# Altium schematic sheet BLDC_SERVO.SchDoc
size A3
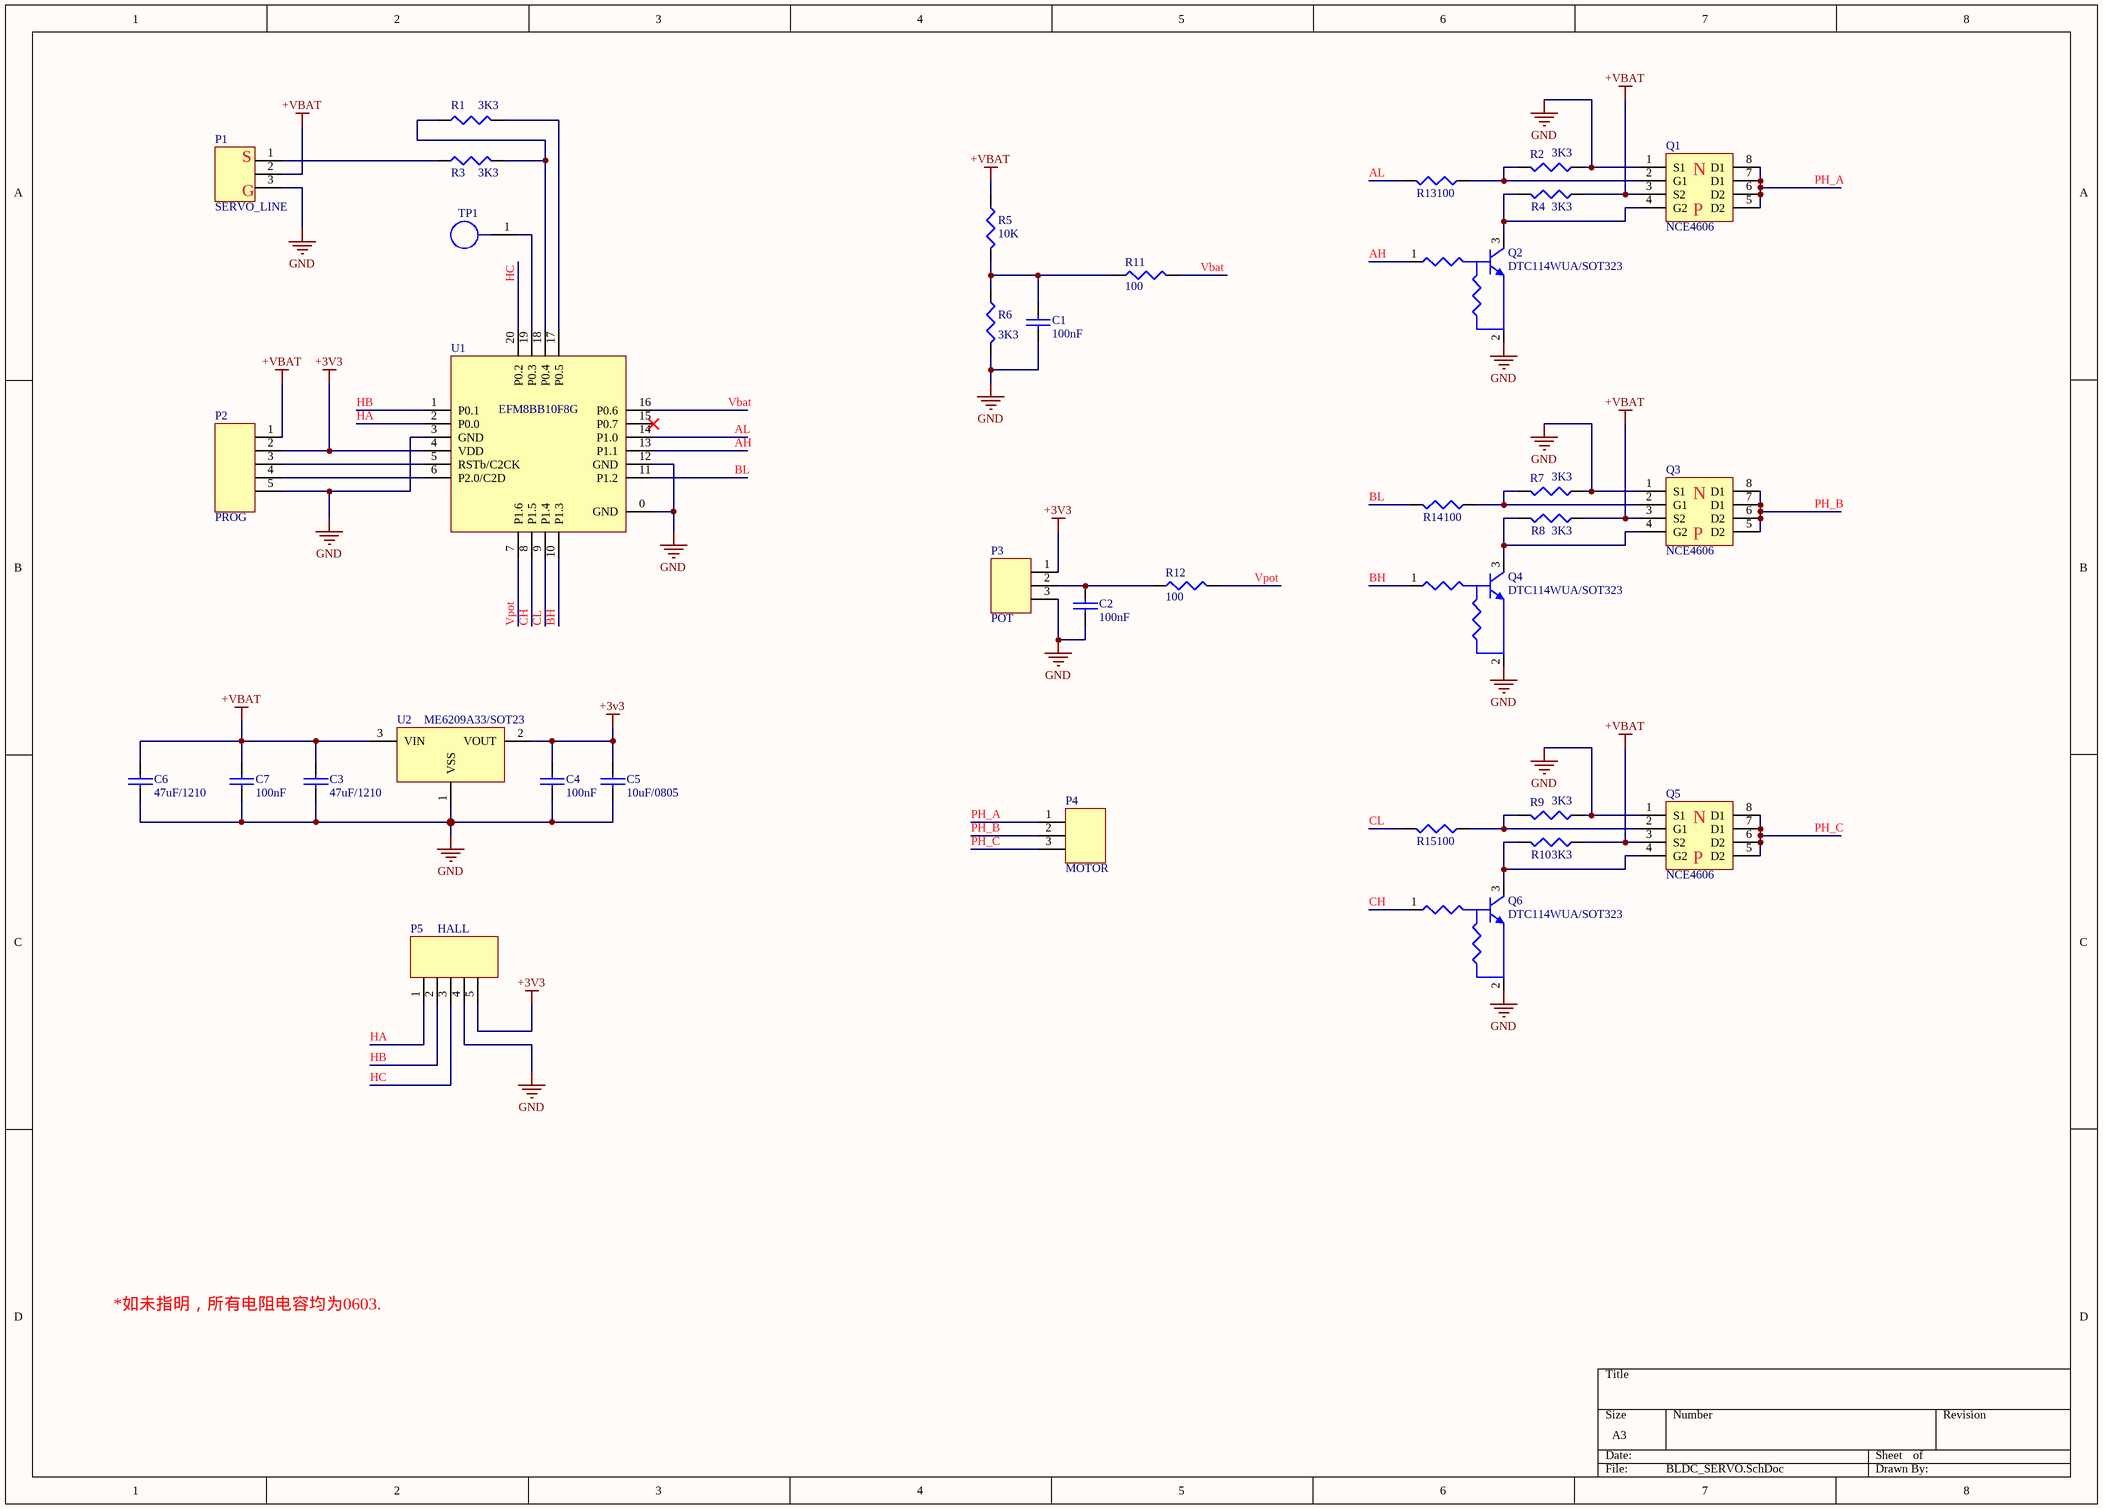
[diagram p0: BLDC_SERVO.SchDoc]

## Parts
C1  100nF  [ZHB_0603]
C2  100nF  [ZHB_0603]
C3  47uF/1210  [ZHB_1210]
C4  100nF  [ZHB_0603]
C5  10uF/0805  [ZHB_0805]
C6  47uF/1210  [ZHB_1210]
C7  100nF  [ZHB_0603]
P1  SERVO_LINE  ['CON_3]
P2  PROG  [PRO_5]
P3  POT  ['CON_3]
P4  MOTOR  ['CON_3]
P5  HALL  [ZHB_125T]
Q1  NCE4606  [ZHB_NCE4606]
Q2  DTC114WUA/SOT323  [ZHB_DTC114WUA]
Q3  NCE4606  [ZHB_NCE4606]
Q4  DTC114WUA/SOT323  [ZHB_DTC114WUA]
Q5  NCE4606  [ZHB_NCE4606]
Q6  DTC114WUA/SOT323  [ZHB_DTC114WUA]
R1  3K3  [ZHB_0603]
R2  3K3  [ZHB_0603]
R3  3K3  [ZHB_0603]
R4  3K3  [ZHB_0603]
R5  10K  [ZHB_0603]
R6  3K3  [ZHB_0603]
R7  3K3  [ZHB_0603]
R8  3K3  [ZHB_0603]
R9  3K3  [ZHB_0603]
R10  3K3  [ZHB_0603]
R11  100  [ZHB_0603]
R12  100  [ZHB_0603]
R13  100  [ZHB_0603]
R14  100  [ZHB_0603]
R15  100  [ZHB_0603]
TP1  PAD  [Check_point]  (value not drawn)
U1  EFM8BB10F8G  [ZHB_EFM8B10F8G]
U2  ME6209A33/SOT23  [ZHB_ME6208]

## Nets
+3V3: C4.2 C5.2 P2.2 P3.1 P5.5 U1.4(VDD) U2.2(VOUT)
+VBAT: C3.2 C6.2 C7.2 P1.2 P2.1 Q1.3(S2) Q3.3(S2) Q5.3(S2) R4.1 R5.1 R8.1 R10.1 U2.3(VIN)
GND: C1.1 C2.1 C3.1 C4.1 C5.1 C6.1 C7.1 P1.3 P2.5 P3.3 P5.4 Q1.1(S1) Q2.2 Q3.1(S1) Q4.2 Q5.1(S1) Q6.2 R2.1 R6.2 R7.1 R9.1 U1.0(GND) U1.3(GND) U1.12(GND) U2.1(VSS)
AH: Q2.1 U1.13(P1.1)
AL: R13.2 U1.14(P1.0)
BH: Q4.1 U1.10(P1.3)
BL: R14.2 U1.11(P1.2)
CH: Q6.1 U1.8(P1.5)
CL: R15.2 U1.9(P1.4)
HA: P5.1 U1.2(P0.0)
HB: P5.2 U1.1(P0.1)
HC: P5.3 U1.20(P0.2)
PH_A: P4.1 Q1.5(D2) Q1.6(D2) Q1.7(D1) Q1.8(D1)
PH_B: P4.2 Q3.5(D2) Q3.6(D2) Q3.7(D1) Q3.8(D1)
PH_C: P4.3 Q5.5(D2) Q5.6(D2) Q5.7(D1) Q5.8(D1)
Vbat: R11.2 U1.16(P0.6)
Vpot: R12.2 U1.7(P1.6)
NetC1_2: C1.2 R5.2 R6.1 R11.1
NetC2_2: C2.2 P3.2 R12.1
NetP1_1: P1.1 R3.1
NetP2_3: P2.3 U1.5(RSTb/C2CK)
NetP2_4: P2.4 U1.6(P2.0/C2D)
NetQ1_2: Q1.2(G1) R2.2 R13.1
NetQ1_4: Q1.4(G2) Q2.3 R4.2
NetQ3_2: Q3.2(G1) R7.2 R14.1
NetQ3_4: Q3.4(G2) Q4.3 R8.2
NetQ5_2: Q5.2(G1) R9.2 R15.1
NetQ5_4: Q5.4(G2) Q6.3 R10.2
NetR1_1: R1.1 R3.2 U1.18(P0.4)
NetR1_2: R1.2 U1.17(P0.5)
NetTP1_1: TP1.1 U1.19(P0.3)

Not connected (* = marked no-connect by the designer): U1 15(P0.7)*

## Notes on the sheet
- (near P1) S
- (near P1) G
- *如未指明，所有电阻电容均为0603.
- (in symbol FDS8858DS) N; P

## Library data of the parts
C1-C7 = CAP(SMD)
P1 P3 P4 = HEAD_3X1_V
P2 P5 = HEAD_5X1_V
Q1 Q3 Q5 = FDS8858DS
Q2 Q4 Q6 = DTC114WUA
R1-R15 = RES(SMD)
TP1 = TP
U2 = ME6209A33